# Altium project SMARTING.PrjPcb
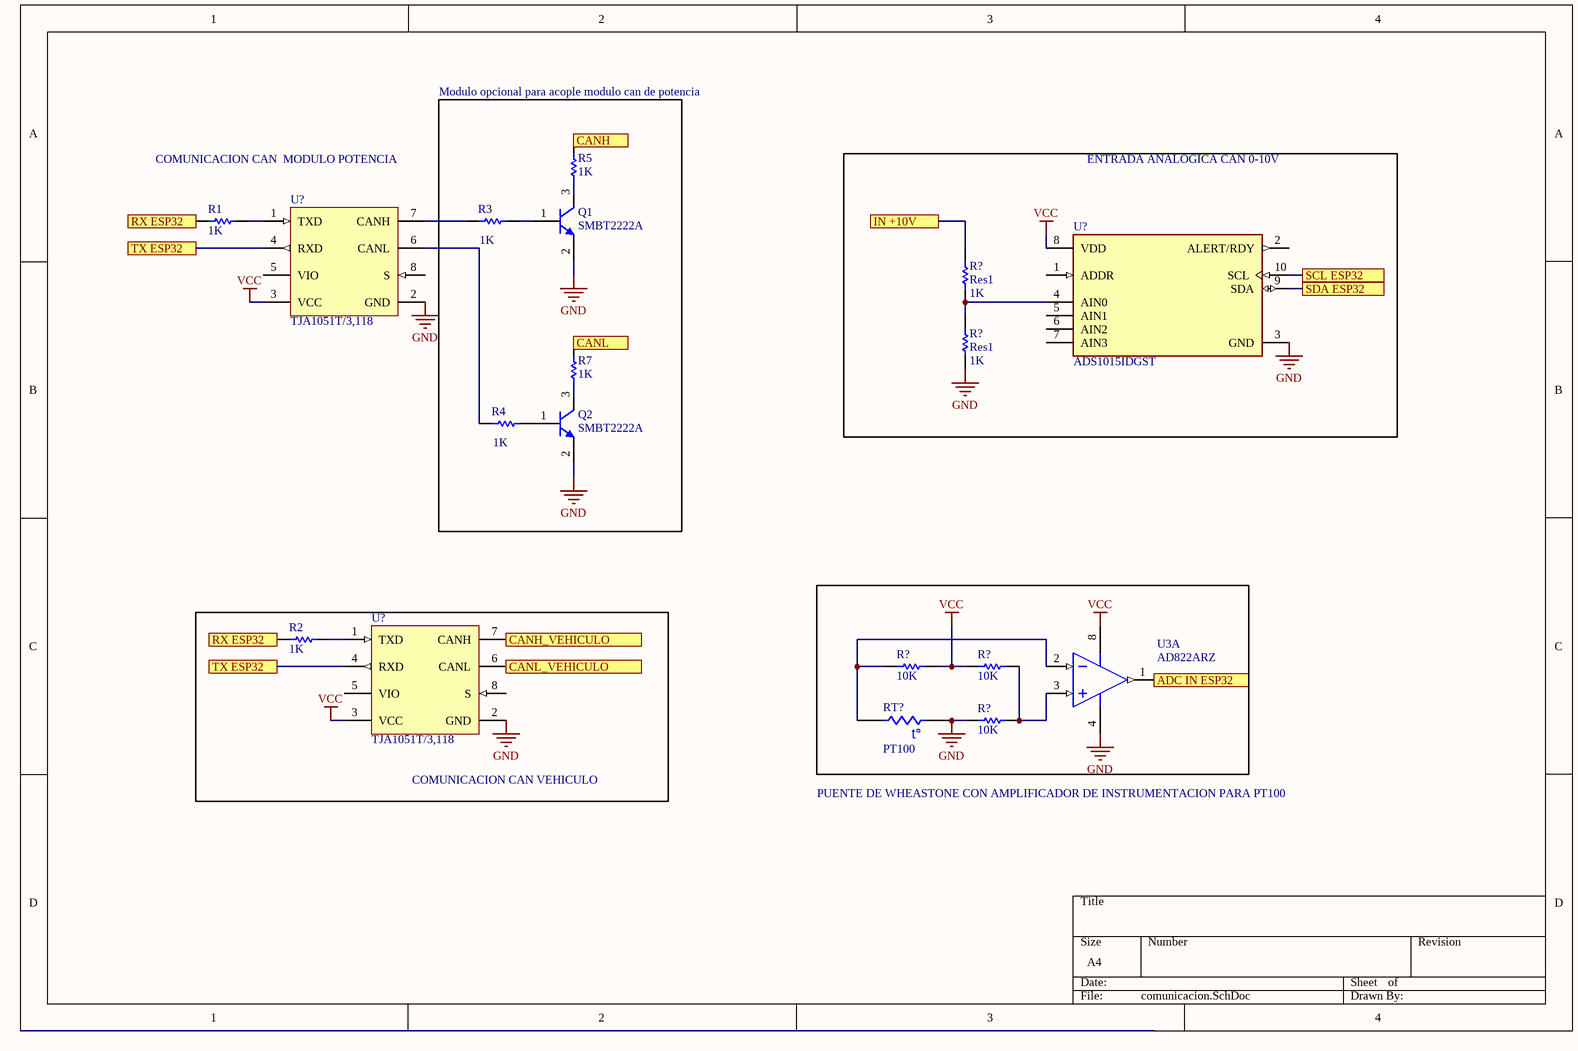
[diagram p0: comunicacion.SchDoc]
2 sheets, 26 parts. Net scope: flat (ports and power ports of the same name join across sheets).
Sheets:
  comunicacion.SchDoc
  esp32_ethernet1.SchDoc

## Sheet comunicacion.SchDoc
size A4; SheetNumber: 1; SheetTotal: 2

### Parts
(Parts that share a designator on the sheet are numbered #1, #2 ... from top to bottom, then left to right.)
Q1  SMBT2222A  [INF-SOT23_L]
Q2  SMBT2222A  [INF-SOT23_L]
R1  value 1K  (hidden comment: Resistor)
R2  value 1K  (hidden comment: Resistor)
R3  value 1K  (hidden comment: Resistor)
R4  value 1K  (hidden comment: Resistor)
R5  value 1K  (hidden comment: Resistor)
R7  value 1K  (hidden comment: Resistor)
R?#1  Res1  value 1K  [AXIAL-0.3]
R?#2  Res1  value 1K  [AXIAL-0.3]
R?#3  value 10K  (hidden comment: Resistor)
R?#4  value 10K  (hidden comment: Resistor)
R?#5  value 10K  (hidden comment: Resistor)
RT?  PT100  [6-0805_N]
U3  AD822ARZ  [ADI-R-8_M]  (part A of 2)
U?#1  TJA1051T/3,118  [NXP-SOIC-8_L]
U?#2  ADS1015IDGST  [FP-DGS0010A-MFG]
U?#3  TJA1051T/3,118  [NXP-SOIC-8_L]

### Blocks framed on the sheet
Modulo opcional para acople modulo can de potencia: Q1 Q2 R3-R5 R7
ENTRADA ANALOGICA CAN 0-10V: R?#1 R?#2 U?#2
COMUNICACION CAN VEHICULO: R2 U?#3

### Ports
ADC IN ESP32, CANH, CANH_VEHICULO, CANL, CANL_VEHICULO, IN +10V, RX ESP32, SCL ESP32, SDA ESP32, TX ESP32

### Nets
GND: Q1.2(E) Q2.2(E) R?#2.1 R?#5.1 RT?.1 U3.4(-V) U?#1.2(GND) U?#2.3(GND) U?#3.2(GND)
VCC: R?#3.2 R?#4.1 U3.8(+V) U?#1.3(VCC) U?#2.8(VDD) U?#3.3(VCC)
NetMD?_6: U3.1(OUT_1) ; port ADC IN ESP32
NetMD?_27: U?#1.4(RXD) U?#3.4(RXD) ; port TX ESP32
NetMD?_28: R1.1 R2.1 ; port RX ESP32
NetMD?_33: U?#2.9(SDA) ; port SDA ESP32
NetMD?_36: U?#2.10(SCL) ; port SCL ESP32
NetQ1_1: Q1.1(B) R3.2
NetQ1_3: Q1.3(C) R5.1
NetQ2_1: Q2.1(B) R4.2
NetQ2_3: Q2.3(C) R7.1
NetR1_2: R1.2 U?#1.1(TXD)
NetR2_2: R2.2 U?#3.1(TXD)
NetR3_1: R3.1 U?#1.7(CANH)
NetR4_1: R4.1 U?#1.6(CANL)
NetR5_2: R5.2 ; port CANH
NetR7_2: R7.2 ; port CANL
NetR?#1_1: R?#1.1 R?#2.2 U?#2.4(AIN0)
NetR?#1_2: R?#1.2 ; port IN +10V
NetR?#3_1: R?#3.1 RT?.2 U3.2(-IN_1)
NetR?#4_2: R?#4.2 R?#5.2 U3.3(+IN_1)
NetU?#3_6: U?#3.6(CANL) ; port CANL_VEHICULO
NetU?#3_7: U?#3.7(CANH) ; port CANH_VEHICULO

Not connected (* = marked no-connect by the designer): U?#1 5(VIO) 8(S); U?#2 1(ADDR) 2(ALERT/RDY) 5(AIN1) 6(AIN2) 7(AIN3); U?#3 5(VIO) 8(S)

### Notes on the sheet
- COMUNICACION CAN  MODULO POTENCIA
- PUENTE DE WHEASTONE CON AMPLIFICADOR DE INSTRUMENTACION PARA PT100
- (in symbol Res Thermal) t°

### Library data of the parts
Q1 Q2 = CMP-1178-00004-1: NPN Silicon Switching Transistor, 40 V VCEO, 600 mA IC, SOT23, Reel, Green; Manufacturer: Infineon; IC (max): 600 mA; IC: 150 mA; VCE: 10 V; VCEO (max): 40 V; VCBO (max): 75 V; VEBO (max): 6 V; ICBO (max): 10 nA; Green: TRUE; Mounting Technology: Surface Mount; PackageDescription: 3-Pin Small Outline Transistor Package, 1.3 x 2.9 mm Body, 0.95 mm Pitch; ComponentLink1Description: Manufacturer URL; ComponentLink3URL: http://www.infineon.com/dgdl/SOT23-Package_Overview.pdf?folderId=db3a30431936bc4b0119532290053c66&fileId=db3a30431936bc4b0119533468123c85; PackageVersion: Apr-08; VCE (max): 10 V; ComponentLink1URL: http://www.infineon.com/; Packing: Reel; ComponentLink2URL: http://www.infineon.com/dgdl/smbt2222a_mmbt2222a.pdf?folderId=db3a30431441fb5d011445fab851018e&fileId=db3a30431441fb5d011445fbaff0018f; PartNumber: SMBT2222A; PackageReference: SOT23; ComponentLink3Description: Package Specification; Polarity: NPN; ComponentLink2Description: Datasheet
R1-R5 R7 R?#3-R?#5 = Resistor: TC1: 0; SimulationGenericComponent: True; TC2: 0
R?#1 R?#2 = Res1: Resistor; Published: 8-Jun-2000; LatestRevisionDate: 17-Jul-2002; LatestRevisionNote: Re-released for DXP Platform.; PackageReference: AXIAL-0.3; Publisher: Altium Limited; PackageDescription: Axial Device, Thru-Hole; 2 Leads; 0.3 in Pin Spacing
RT? = Res Thermal: Thermistor; Published: 24-Mar-1999; LatestRevisionDate: 29-May-2009; LatestRevisionNote: IPC-7351 Footprint Added.; PackageVersion: Mar-2003; PackageReference: 6-0805; Publisher: Altium Limited; PackageDescription: Chip Resistor 0805 Case Size; Code_IPC: RESC2012
U3 = CMP-0384-00785-2: Double Channel Rail-to-Rail Operational Amplifier, 1.9 MHz BW, 3 V/us SR, Industrial, 8-pin SOIC (R-8), Tube; Manufacturer: Analog Devices; Generic Part Number: AD822; Iq/Amp: 900uA; V Span Max: 30V; Input Offset Voltage: 100uV; Amplifiers Per Package: 2; Input Bias Current: 2pA; V Span Min: 5V; Small Signal Bandwidth: 1.9MHz; Slew Rate: 3V/us; ComponentLink1Description: Manufacturer URL; PackageDescription: 8-Pin Standard Small Outline Package, Body 3.9 x 4.9 mm, Pitch 1.27 mm; PackageReference: R-8; DatasheetVersion: Rev. I; PartNumber: AD822ARZ; RevisionNote: Reference Circuit URL fixed; PackageVersion: 060506-A; Code_JEDEC: MS-012-AA; ComponentLink4Description: Reference Circuit; ComponentLink2Description: Datasheet; Mounting Technology: Surface Mount; ComponentLink4URL: http://www.analog.com/en/all-operational-amplifiers-op-amps/operational-amplifiers-op-amps/ad822/products/product.html#product-recommendations; ComponentLink1URL: http://www.analog.com/en/index.html; ComponentLink2URL: http://www.analog.com/static/imported-files/data_sheets/AD822.pdf; ComponentLink3Description: Package Specification; ComponentLink3URL: http://www.analog.com/static/imported-files/packages/PKG_PDF/SOIC_Narrow%20(R)/R_8.pdf
U?#1 U?#3 = CMP-2000-07245-1: High-Speed CAN Transceiver, 3 to 5 V, 8-Pin SOIC (SOT96-1), RoHS, Tape and Reel; Manufacturer: NXP; Power Down Mode: Normal/Silent; Rad Hardened: No; Number of Transceivers: 1; Supply Current: 70mA; Operating Supply Voltage (Max): 5.5V; Operating Supply Voltage (Typ): 5V; Operating Supply Voltage (Min): 4.5V; Standard Supported: ISO11898-2; Data Rate: 1Mbps; DELETED: Compliant; Operating Temperature (Min): -40C; Datasheet Version: Rev. 7, 01/2015; Pin Count: 8; Operating Temperature (Max): 125C; Package Description: 8-Pin Small Outline Integrated Circuit, Body 4.9 x 3.9 mm, Pitch 1.27 mm; Category: Transceiver; Packaging: TapeandReel; Mounting: SurfaceMount; Package Reference: SOT96-1; Operating Temperature Classification: Automotive; Mounting Technology: SurfaceMount; Package Type: SO; Manufacturer URL: http://www.nxp.com/; Datasheet URL: http://www.nxp.com/documents/data_sheet/TJA1051.pdf
U?#2 = CMP-0003-00377-3: IC ADC 12BIT SIGMA-DELTA 10VSSOP; Supply Type: Single; Number of Converters: 1; Number of Bits: 12; Number of Inputs: 4; Sampling Rate: 3.3KS/s; Conversion Rate: 3300S/s; Min Supply Voltage: 2V; Interface: I2C; Operating Supply Voltage: 3.3V; Polarity: Bipolar; Nominal Supply Current: 150uA; Integral Nonlinearity (INL): 0.5LSB; Max Power Dissipation: 900uW; Max Supply Voltage (DC): 5.5V; Resolution: 12b; Width: 3mm; Min Operating Temperature: -40°C; Contact Plating: Gold; Number of A/D Converters: 1; Max Operating Temperature: 125°C; Height: 1.02mm; Case/Package: VSSOP; Package Quantity: 250; Number of Elements: 1; Lead Free: Lead Free; Number of Pins: 10; Radiation Hardening: No; Termination: SMD/SMT; Length: 3mm; Min Supply Voltage (DC): 2V; Power Dissipation: 900uW; Number of Channels: 4; Max Supply Voltage: 5.5V; REACH SVHC: No SVHC; Packaging: Tape and Reel

## Sheet esp32_ethernet1.SchDoc
size A4; SheetNumber: 2; SheetTotal: 2
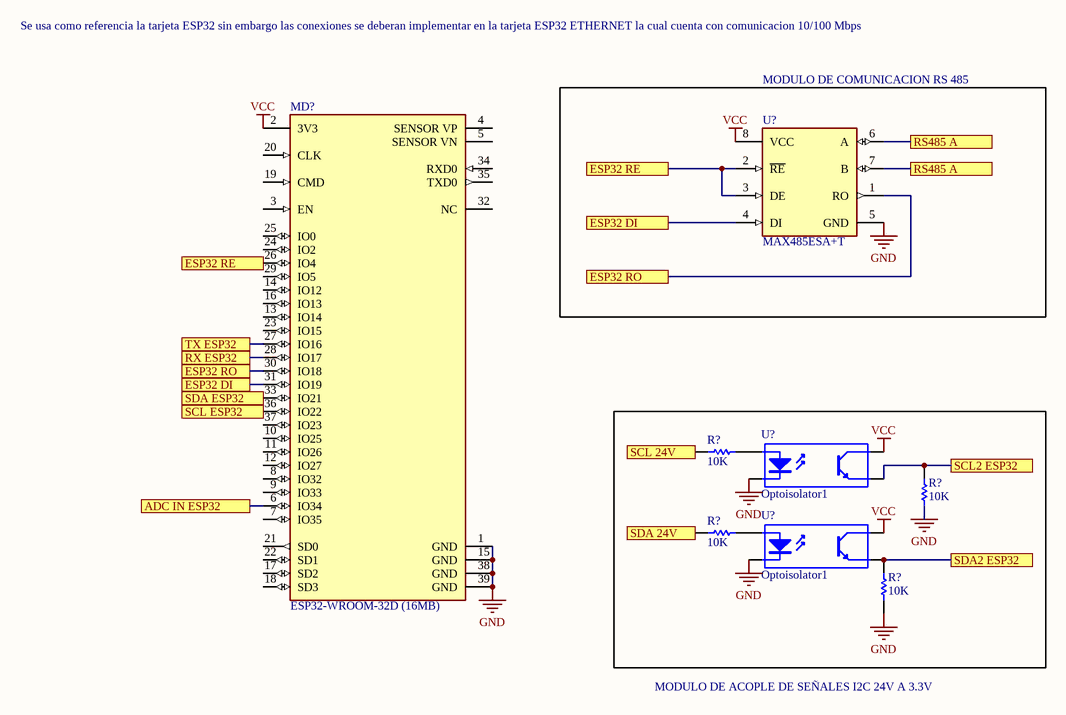
[diagram p1: esp32_ethernet1.SchDoc]

### Parts
(Parts that share a designator on the sheet are numbered #1, #2 ... from top to bottom, then left to right.)
MD?  ESP32-WROOM-32D (16MB)  [FP-ESP32-WROOM-32D_16MB-MFG]
R?#6  value 10K  (hidden comment: Resistor)
R?#7  value 10K  (hidden comment: Resistor)
R?#8  value 10K  (hidden comment: Resistor)
R?#9  value 10K  (hidden comment: Resistor)
U?#4  MAX485ESA+T  [FP-S8-2-MFG]
U?#5  Optoisolator1  [DIP-4]
U?#6  Optoisolator1  [DIP-4]

### Blocks framed on the sheet
MODULO DE COMUNICACION RS 485: U?#4

### Ports
ADC IN ESP32, ESP32 DI, ESP32 RE, ESP32 RO, RS485 A, RX ESP32, SCL2 ESP32 , SCL 24V, SCL ESP32, SDA2 ESP32 , SDA 24V, SDA ESP32, TX ESP32

### Nets
GND: MD?.1(GND) MD?.15(GND) MD?.38(GND) MD?.39(GND) R?#7.1 R?#9.1 U?#4.5(GND) U?#5.2(K) U?#6.2(K)
VCC: MD?.2(3V3) U?#4.8(VCC) U?#5.4(C) U?#6.4(C)
NetMD?_6: MD?.6(IO34) ; port ADC IN ESP32
NetMD?_26: MD?.26(IO4) U?#4.2(~{RE}) U?#4.3(DE) ; port ESP32 RE
NetMD?_27: MD?.27(IO16) ; port TX ESP32
NetMD?_28: MD?.28(IO17) ; port RX ESP32
NetMD?_30: MD?.30(IO18) U?#4.1(RO) ; port ESP32 RO
NetMD?_31: MD?.31(IO19) U?#4.4(DI) ; port ESP32 DI
NetMD?_33: MD?.33(IO21) ; port SDA ESP32
NetMD?_36: MD?.36(IO22) ; port SCL ESP32
NetR?#6_1: R?#6.1 ; port SCL 24V
NetR?#6_2: R?#6.2 U?#5.1(A)
NetR?#7_2: R?#7.2 U?#5.3(E) ; port SCL2 ESP32 
NetR?#8_1: R?#8.1 ; port SDA 24V
NetR?#8_2: R?#8.2 U?#6.1(A)
NetR?#9_2: R?#9.2 U?#6.3(E) ; port SDA2 ESP32 
NetU?#4_6: U?#4.6(A) U?#4.7(B) ; port RS485 A

Not connected (* = marked no-connect by the designer): MD? 3(EN) 4(SENSOR_VP) 5(SENSOR_VN) 7(IO35) 8(IO32) 9(IO33) 10(IO25) 11(IO26) 12(IO27) 13(IO14) 14(IO12) 16(IO13) 17(SD2) 18(SD3) 19(CMD) 20(CLK) 21(SD0) 22(SD1) 23(IO15) 24(IO2) 25(IO0) 29(IO5) 32(NC) 34(RXD0) 35(TXD0) 37(IO23)

### Notes on the sheet
- Se usa como referencia la tarjeta ESP32 sin embargo las conexiones se deberan implementar en la tarjeta ESP32 ETHERNET la cual cuenta con comunicacion 10/100 Mbps
- MODULO DE ACOPLE DE SEÑALES I2C 24V A 3.3V

### Library data of the parts
MD? = CMP-194065-000022-1: RX TXRX MOD WIFI TRACE ANT SMD; Data Rate: 150Mbps; Memory Size: 536KB; Interface: I2C; Frequency: 2.5GHz; Sensitivity: -98dBm; Packaging: Tape and Reel; Min Operating Temperature: -40°C; Max Operating Temperature: 85°C; Mount: Surface Mount; Case/Package: SMD/SMT
R?#6-R?#9 = Resistor: TC1: 0; SimulationGenericComponent: True; TC2: 0
U?#4 = CMP-05679-000009-1: IC TRANSCEIVER HALF 1/1 8SOIC; Manufacturer: Maxim Integrated; Min Supply Voltage: 4.75V; Nominal Supply Current: 0.5mA; Number Of Transmitters: 1; Data Rate: 2.5Mbits/s; Interface: RS-485,RS-422; Description: 1/1 Transceiver Half RS422, RS485 8-SOIC; Standoff Height: 0.1mm; Max Supply Voltage: 5.25V; Simplex Duplex: Half-Duplex; Package: S8-2; Temperature: -40°C to +85°C; Device Class L1: Integrated Circuits (ICs); Footprint Url: https://pdfserv.maximintegrated.com/land_patterns/90-0096.PDF; ComponentLink2URL: https://datasheets.maximintegrated.com/en/ds/MAX1487-MAX491.pdf; Height: 1.75mm; Mouser Description: RS-422/RS-485 Interface IC RS-485/RS-422 Transceiver; Octopart: https://octopart.com/max485esa%2Bt-maxim+integrated-40011239; RoHS: TRUE; ComponentLink2Description: Datasheet; Temperature Range Low: -40°C; Number Of Receivers: 1; Manufacturer Part Number: MAX485ESA+T; Ipc Land Pattern Name: SOIC127P600X155-8; Device Class L3: RS-232 / RS-422 / RS-485 Interface ICs; Automotive: No; Digikey Description: IC TRANSCEIVER HALF 1/1 8SOIC; Temperature Range High: +85°C; Category: IC; Device Class L2: Interface ICs; Lead Free: Yes
U?#5 U?#6 = Optoisolator1: 4-Pin Phototransistor Optocoupler; Published: 24-Mar-1999; LatestRevisionDate: 04-Mar-2005; LatestRevisionNote: Sch pins 3 & 4 Swapped.; DatasheetVersion: Nov-2003; PackageReference: DIP-4; Publisher: Altium Limited

## Nets that join several sheets
GND: comunicacion (9 pins), esp32_ethernet1 (9 pins)
VCC: comunicacion (6 pins), esp32_ethernet1 (MD?.2 U?#4.8 U?#5.4 U?#6.4)
NetMD?_6: comunicacion (U3.1), esp32_ethernet1 (MD?.6)
NetMD?_27: comunicacion (U?#1.4 U?#3.4), esp32_ethernet1 (MD?.27)
NetMD?_28: comunicacion (R1.1 R2.1), esp32_ethernet1 (MD?.28)
NetMD?_33: comunicacion (U?#2.9), esp32_ethernet1 (MD?.33)
NetMD?_36: comunicacion (U?#2.10), esp32_ethernet1 (MD?.36)